# Altium schematic sheet Config.SchDoc
size 513 x 386 mm
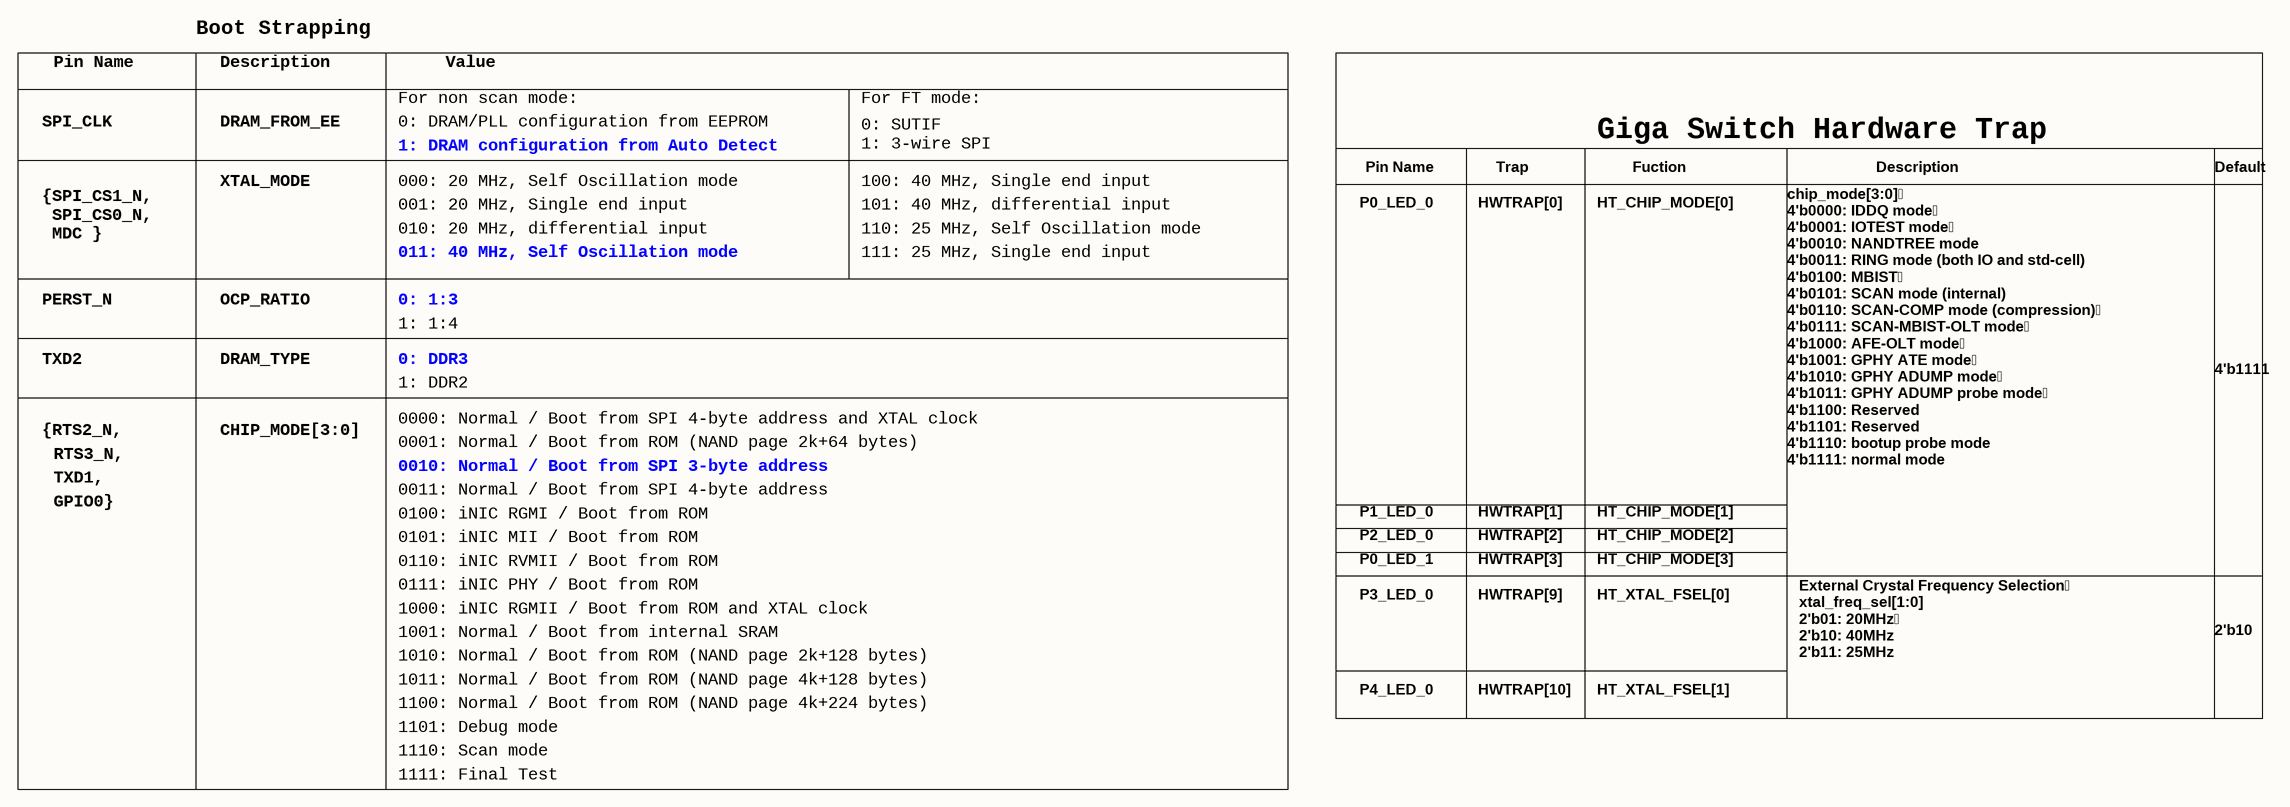
[diagram p0: Config.SchDoc]

## Notes on the sheet
- Pin Name
- Boot Strapping
- Description
- Value
- SPI_CLK
- DRAM_FROM_EE
- For non scan mode:
- 0: DRAM/PLL configuration from EEPROM
- For FT mode:
- XTAL_MODE
- 1: DRAM configuration from Auto Detect
- 000: 20 MHz, Self Oscillation mode
- 100: 40 MHz, Single end input
- 0: SUTIF
  1: 3-wire SPI
- Trap
- Giga Switch Hardware Trap
- Fuction
- Default
- {SPI_CS1_N,
  SPI_CS0_N,
  MDC }
- 001: 20 MHz, Single end input
- 010: 20 MHz, differential input
- 101: 40 MHz, differential input
- 110: 25 MHz, Self Oscillation mode
- P0_LED_0
- HWTRAP[0]
- HT_CHIP_MODE[0]
- PERST_N
- OCP_RATIO
- 0: 1:3
- 011: 40 MHz, Self Oscillation mode
- 111: 25 MHz, Single end input
- TXD2
- DRAM_TYPE
- 0: DDR3
- 1: 1:4
- 4'b1111
- 1: DDR2
- 0000: Normal / Boot from SPI 4-byte address and XTAL clock
- {RTS2_N,
- RTS3_N,
- TXD1,
- CHIP_MODE[3:0]
- 0001: Normal / Boot from ROM (NAND page 2k+64 bytes)
- 0010: Normal / Boot from SPI 3-byte address
- chip_mode[3:0]
  4'b0000: IDDQ mode
  4'b0001: IOTEST mode
  4'b0010: NANDTREE mode
  4'b0011: RING mode (both IO and std-cell)
  4'b0100: MBIST
  4'b0101: SCAN mode (internal)
  4'b0110: SCAN-COMP mode (compression)
  4'b0111: SCAN-MBIST-OLT mode
  4'b1000: AFE-OLT mode
  4'b1001: GPHY ATE mode
  4'b1010: GPHY ADUMP mode
  4'b1011: GPHY ADUMP probe mode
  4'b1100: Reserved
  4'b1101: Reserved
  4'b1110: bootup probe mode
  4'b1111: normal mode
- GPIO0}
- 0011: Normal / Boot from SPI 4-byte address
- 0100: iNIC RGMI / Boot from ROM
- 0101: iNIC MII / Boot from ROM
- P1_LED_0
- P2_LED_0
- HWTRAP[1]
- HWTRAP[2]
- HT_CHIP_MODE[2]
- HT_CHIP_MODE[1]
- 0111: iNIC PHY / Boot from ROM
- 0110: iNIC RVMII / Boot from ROM
- P0_LED_1
- P3_LED_0
- HWTRAP[9]
- HWTRAP[3]
- HT_XTAL_FSEL[0]
- HT_CHIP_MODE[3]
- 1000: iNIC RGMII / Boot from ROM and XTAL clock
- 1001: Normal / Boot from internal SRAM
- 1010: Normal / Boot from ROM (NAND page 2k+128 bytes)
- External Crystal Frequency Selection
  xtal_freq_sel[1:0]
  2'b01: 20MHz
  2'b10: 40MHz
  2'b11: 25MHz
- 2'b10
- 1100: Normal / Boot from ROM (NAND page 4k+224 bytes)
- 1011: Normal / Boot from ROM (NAND page 4k+128 bytes)
- P4_LED_0
- HWTRAP[10]
- HT_XTAL_FSEL[1]
- 1101: Debug mode
- 1110: Scan mode
- 1111: Final Test